# Altium schematic sheet FP6291 boost converter high power.SchDoc: FP6291 Boost converter
size A4; Date: 06.05.2016; Author: Pavel Nadein; DrawnBy: Pavel Nadein; Revision: P1A; DocumentName: FP6291 Boost converter
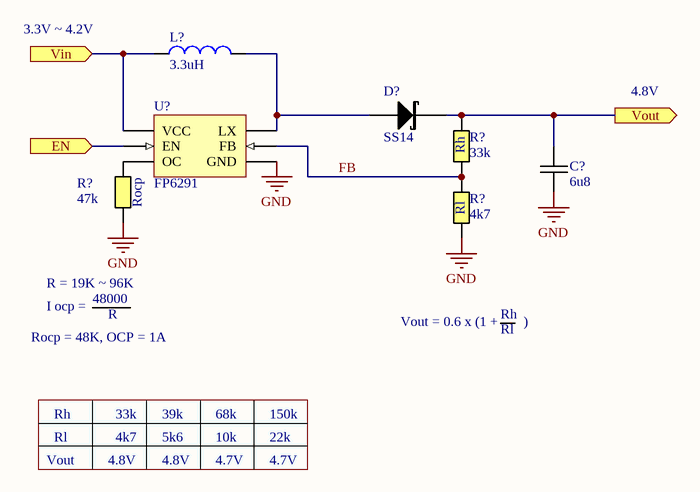
[diagram p0: FP6291 boost converter high power.SchDoc]

## Parts
(Parts that share a designator on the sheet are numbered #1, #2 ... from top to bottom, then left to right.)
C?  6u8  [CAPC0805(2012)75_N]
D?  SS14  [SMA]
L?  3.3uH  [CD43]
R?#1  33k  [RESC0603(1608)_N]
R?#2  47k  [RESC0603(1608)_N]
R?#3  4k7  [RESC0603(1608)_N]
U?  FP6291  [SOT23-6]

## Ports
EN (in), Vin (in), Vout (out)

## Nets
GND: C?.2 R?#2.1 R?#3.1 U?.2(GND)
EN: U?.4(EN) ; port EN
FB: R?#1.1 R?#3.2 U?.3(FB)
Vin: L?.1 U?.5(VCC) ; port Vin
Vout: C?.1 D?.K R?#1.2 ; port Vout
NetD?_A: D?.A L?.2 U?.1(LX)
NetR?#2_2: R?#2.2 U?.6(OC)

## Notes on the sheet
- 3.3V ~ 4.2V
- (near R?#1) Rh
- 4.8V
- (near R?#2) Rocp
- (near R?#3) Rl
- I ocp =
- R = 19K ~ 96K
- 48000
- Rocp = 48K, OCP = 1A
- R
- Vout = 0.6 x (1 +
- Rh
- Rl
- )
- Vout
- 33k
- 4k7
- 39k
- 5k6
- 4.7V
- 68k
- 10k
- 150k
- 22k

## Library data of the parts
C? = Capacitor M: Ceramic capacitor Medium density; Value: 6u8
D? = SS14: Surface Mount Schottky Barrier Rectifier; If (av): 1.0A; Vrrm: 40V; Ifsm: 40A; Vf: 0.5 ~ 0.75V; Supplier 1: Newark; Supplier Part Number 1: 05R5585
L? = Inductor: Value: 3.3uH
R?#1-R?#3 = Resistor M: Resistor Medium Density
  R?#1: Value: 33k
  R?#2: Value: 47k
  R?#3: Value: 4k7
U? = FP6291: Current mode boost up converter; Vin: 2.6 ~ 5.5V; Freqency: 1MHz; Vref: 0.6V; Imax: 2A; Vout max: 12V